# Altium schematic sheet Hall Effect Sensors Panel.SchDoc
size B; SheetNumber: 1; SheetTotal: 1
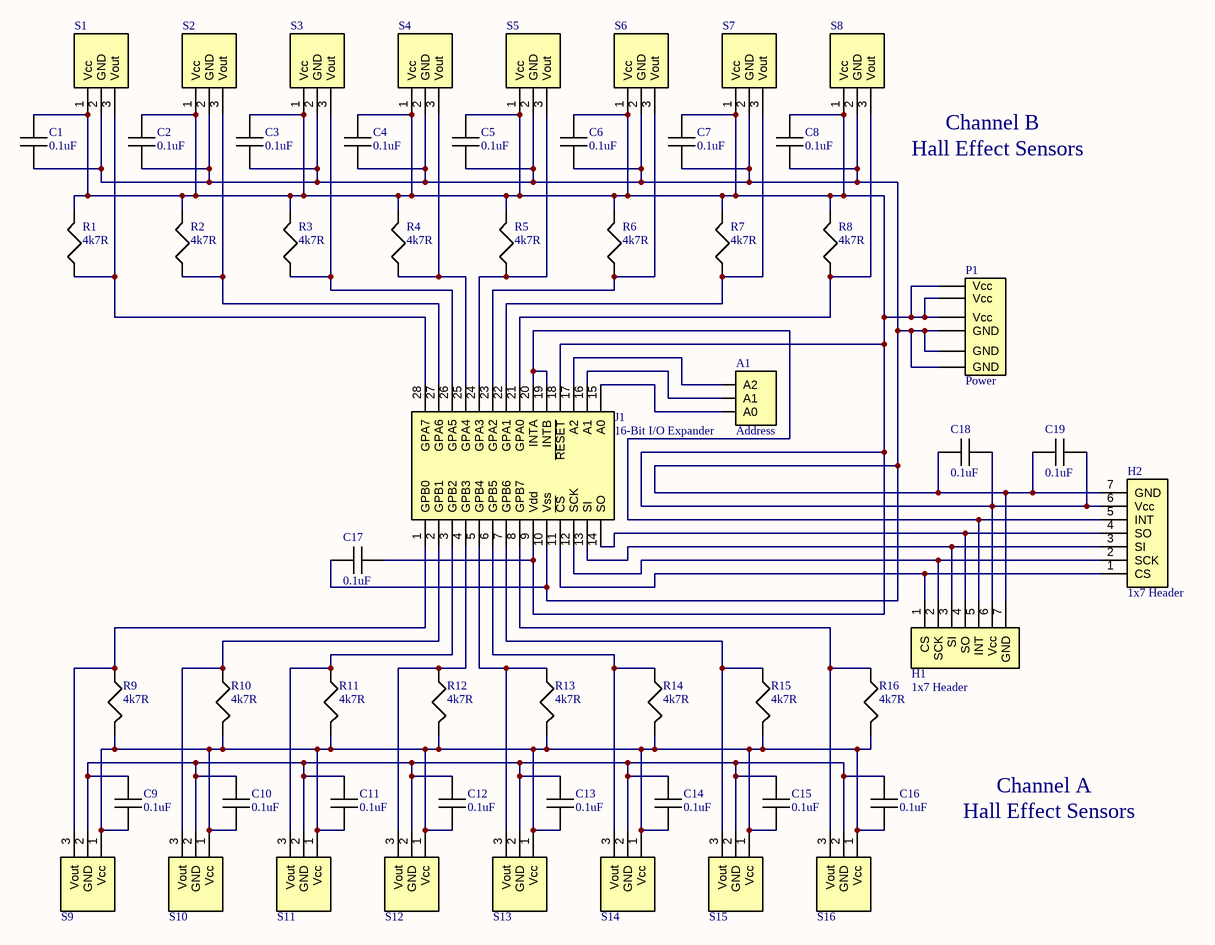
[diagram p0: Hall Effect Sensors Panel.SchDoc]

## Parts
A1  Address  [Address]
C1  0.1uF  [C320C104K5R5TA]
C2  0.1uF  [C320C104K5R5TA]
C3  0.1uF  [C320C104K5R5TA]
C4  0.1uF  [C320C104K5R5TA]
C5  0.1uF  [C320C104K5R5TA]
C6  0.1uF  [C320C104K5R5TA]
C7  0.1uF  [C320C104K5R5TA]
C8  0.1uF  [C320C104K5R5TA]
C9  0.1uF  [C320C104K5R5TA]
C10  0.1uF  [C320C104K5R5TA]
C11  0.1uF  [C320C104K5R5TA]
C12  0.1uF  [C320C104K5R5TA]
C13  0.1uF  [C320C104K5R5TA]
C14  0.1uF  [C320C104K5R5TA]
C15  0.1uF  [C320C104K5R5TA]
C16  0.1uF  [C320C104K5R5TA]
C17  0.1uF  [C320C104K5R5TA]
C18  0.1uF  [C320C104K5R5TA]
C19  0.1uF  [C320C104K5R5TA]
H1  1x7 Header  [PCB Header]
H2  1x7 Header  [PCB Header]
J1  16-Bit I/O Expander  [MCP23S17-E/SP]
P1  Power  [Power]
R1  4k7R  [CFR100J4K7]
R2  4k7R  [CFR100J4K7]
R3  4k7R  [CFR100J4K7]
R4  4k7R  [CFR100J4K7]
R5  4k7R  [CFR100J4K7]
R6  4k7R  [CFR100J4K7]
R7  4k7R  [CFR100J4K7]
R8  4k7R  [CFR100J4K7]
R9  4k7R  [CFR100J4K7]
R10  4k7R  [CFR100J4K7]
R11  4k7R  [CFR100J4K7]
R12  4k7R  [CFR100J4K7]
R13  4k7R  [CFR100J4K7]
R14  4k7R  [CFR100J4K7]
R15  4k7R  [CFR100J4K7]
R16  4k7R  [CFR100J4K7]
S1  Hall Effect Sensor  [A1104EUA-T]  (value not drawn)
S2  Hall Effect Sensor  [A1104EUA-T]  (value not drawn)
S3  Hall Effect Sensor  [A1104EUA-T]  (value not drawn)
S4  Hall Effect Sensor  [A1104EUA-T]  (value not drawn)
S5  Hall Effect Sensor  [A1104EUA-T]  (value not drawn)
S6  Hall Effect Sensor  [A1104EUA-T]  (value not drawn)
S7  Hall Effect Sensor  [A1104EUA-T]  (value not drawn)
S8  Hall Effect Sensor  [A1104EUA-T]  (value not drawn)
S9  Hall Effect Sensor  [A1104EUA-T]  (value not drawn)
S10  Hall Effect Sensor  [A1104EUA-T]  (value not drawn)
S11  Hall Effect Sensor  [A1104EUA-T]  (value not drawn)
S12  Hall Effect Sensor  [A1104EUA-T]  (value not drawn)
S13  Hall Effect Sensor  [A1104EUA-T]  (value not drawn)
S14  Hall Effect Sensor  [A1104EUA-T]  (value not drawn)
S15  Hall Effect Sensor  [A1104EUA-T]  (value not drawn)
S16  Hall Effect Sensor  [A1104EUA-T]  (value not drawn)

## Nets
NetA1_1: A1.1(A0) J1.15(A0)
NetA1_2: A1.2(A1) J1.16(A1)
NetA1_3: A1.3(A2) J1.17(A2)
NetC1_1: C1.1 C2.1 C3.1 C4.1 C5.1 C6.1 C7.1 C8.1 C17.2 C18.2 C19.2 H1.6(Vcc) H2.6(Vcc) J1.9(Vdd) J1.18(~{RESET}) P1.1(Vcc) P1.2(Vcc) P1.3(Vcc) R1.2 R2.2 R3.2 R4.2 R5.2 R6.2 R7.2 R8.2 S1.1(Vcc) S2.1(Vcc) S3.1(Vcc) S4.1(Vcc) S5.1(Vcc) S6.1(Vcc) S7.1(Vcc) S8.1(Vcc)
NetC1_2: C1.2 C2.2 C3.2 C4.2 C5.2 C6.2 C7.2 C8.2 C17.1 C18.1 C19.1 H1.7(GND) H2.7(GND) J1.10(Vss) P1.4(GND) P1.5(GND) P1.6(GND) S1.2(GND) S2.2(GND) S3.2(GND) S4.2(GND) S5.2(GND) S6.2(GND) S7.2(GND) S8.2(GND)
NetC9_1: C9.1 C10.1 C11.1 C12.1 C13.1 C14.1 C15.1 C16.1 R9.2 R10.2 R11.2 R12.2 R13.2 R14.2 R15.2 R16.2 S9.1(Vcc) S10.1(Vcc) S11.1(Vcc) S12.1(Vcc) S13.1(Vcc) S14.1(Vcc) S15.1(Vcc) S16.1(Vcc)
NetC9_2: C9.2 C10.2 C11.2 C12.2 C13.2 C14.2 C15.2 C16.2 S9.2(GND) S10.2(GND) S11.2(GND) S12.2(GND) S13.2(GND) S14.2(GND) S15.2(GND) S16.2(GND)
NetH1_1: H1.1(CS) H2.1(CS) J1.11(~{CS})
NetH1_2: H1.2(SCK) H2.2(SCK) J1.12(SCK)
NetH1_3: H1.3(SI) H2.3(SI) J1.13(SI)
NetH1_4: H1.4(SO) H2.4(SO) J1.14(SO)
NetH1_5: H1.5(INT) H2.5(INT) J1.19(INTB) J1.20(INTA)
NetJ1_1: J1.1(GPB0) R9.1 S9.3(Vout)
NetJ1_2: J1.2(GPB1) R10.1 S10.3(Vout)
NetJ1_3: J1.3(GPB2) R11.1 S11.3(Vout)
NetJ1_4: J1.4(GPB3) R12.1 S12.3(Vout)
NetJ1_5: J1.5(GPB4) R13.1 S13.3(Vout)
NetJ1_6: J1.6(GPB5) R14.1 S14.3(Vout)
NetJ1_7: J1.7(GPB6) R15.1 S15.3(Vout)
NetJ1_8: J1.8(GPB7) R16.1 S16.3(Vout)
NetJ1_21: J1.21(GPA0) R8.1 S8.3(Vout)
NetJ1_22: J1.22(GPA1) R7.1 S7.3(Vout)
NetJ1_23: J1.23(GPA2) R6.1 S6.3(Vout)
NetJ1_24: J1.24(GPA3) R5.1 S5.3(Vout)
NetJ1_25: J1.25(GPA4) R4.1 S4.3(Vout)
NetJ1_26: J1.26(GPA5) R3.1 S3.3(Vout)
NetJ1_27: J1.27(GPA6) R2.1 S2.3(Vout)
NetJ1_28: J1.28(GPA7) R1.1 S1.3(Vout)

## Notes on the sheet
- Hall Effect Sensors
- Channel B
- Channel A
- DWG. NO.
- REV.
- SHT.
- THIS DOCUMENT AND THE DATA DISCLOSED HEREIN OR HEREWITH IS THE PROPERTY OF ALTIUM LIMITED AND MAY BE FREELY DISTRIBUTED IN WHOLE. NO RIGHTS ARE RESERVED OR EXPRESS OR IMPLIED WARANTEE GIVEN.
- REVISION
- DESCRIPTION
- DATE
- APPROVED
- ENG:
- APPROVALS
- PROJECT
- DSN:
- CHK:
- REFERENCE DOCUMENTS
- PROJECT REVISION:
- TITLE
- DOCUMENT REVISION:
- DESIGN ITEM:
- BOM:
- FAB DWG:
- PCB DWG:
- ASSY DWG:
- SCALE:
- SIZE
- B
- CAGE CODE
- FILE NAME
- DWG NO.
- SHEET
- OF
- REV

## Library data of the parts
C1-C19 = C320C104K5R5TA: KEMET - C320C104K5R5TA - Multilayer Ceramic Capacitor, Gold Max, 0.1 µF, 50 V, Goldmax, 300 Series, ± 10%, Radial Leaded; Capacitance: 100nF; Dielectric: X7R; Voltage Rating: 50V; Lead/Base Style: Straight; Dissipation Factor: 2.5%; Lead Diameter: 0.51mm; Lead Length: 7mm; Supplier 1: RSComponents; Manufacturer: KEMET; Manufacturer Part Number: C320C104K5R5TA; RoHS: Yes; Category: Ceramic Capacitors; Mount: Through Hole,PCB; Case/Package: Radial; Number of Pins: 2; Dielectric Material: Ceramic; Min Operating Temperature: -55°C; Max Operating Temperature: 125°C; Tolerance: 10%; Packaging: Bulk; Termination: Radial; Voltage Rating (DC): 50V; Package Quantity: 500; Resistor Type: Ceramic; Voltage: 50V; Length: 5.08mm; Width: 0.125inch; Height: 3.18mm; Lead Pitch: 2.54mm; Depth: 3.18mm; Height - Seated (Max): 0.26inch; Radiation Hardening: No; RoHS Compliant: Yes; REACH SVHC: No SVHC; Lead Free: Lead Free; ComponentLink1URL: https://datasheet.ciiva.com/27052/1570161-27052544.pdf?src-supplier=Jameco; ComponentLink1Description: https://datasheet.ciiva.com/27052/1570161-27052544.pdf?src-supplier=Jameco; ComponentLink2URL: https://datasheet.ciiva.com/39122/f3101-goldmax-39122993.pdf?src-supplier=Onlinecomponents.com; ComponentLink2Description: https://datasheet.ciiva.com/39122/f3101-goldmax-39122993.pdf?src-supplier=Onlinecomponents.com; ComponentLink3URL: https://datasheet.ciiva.com/11786/0900766b80717e24-11786584.pdf?src-supplier=RSComponents; ComponentLink3Description: https://datasheet.ciiva.com/11786/0900766b80717e24-11786584.pdf?src-supplier=RSComponents; ComponentLink4URL: https://datasheet.ciiva.com/7817/1732702-7817354.pdf?src-supplier=Element14; ComponentLink4Description: https://datasheet.ciiva.com/7817/1732702-7817354.pdf?src-supplier=Element14; ComponentLink5URL: https://datasheet.ciiva.com/16624/datasheetpn-c320c104k5r5ca-16624750.pdf?src-supplier=Avnet+Europe; ComponentLink5Description: https://datasheet.ciiva.com/16624/datasheetpn-c320c104k5r5ca-16624750.pdf?src-supplier=Avnet+Europe; ComponentLink6URL: https://datasheet.ciiva.com/7817/f3101-goldmax-7817514.pdf?src-supplier=Element14; ComponentLink6Description: https://datasheet.ciiva.com/7817/f3101-goldmax-7817514.pdf?src-supplier=Element14; ComponentLink7URL: https://datasheet.ciiva.com/14585/70095037-14585005.pdf?src-supplier=Allied+Electronics; ComponentLink7Description: https://datasheet.ciiva.com/14585/70095037-14585005.pdf?src-supplier=Allied+Electronics; ComponentLink8URL: https://datasheet.ciiva.com/5389/f3101-goldmax-334604-5389886.pdf?src-supplier=Mouser; ComponentLink8Description: https://datasheet.ciiva.com/5389/f3101-goldmax-334604-5389886.pdf?src-supplier=Mouser; Supplier Part Number 1: 1466304
H1 H2 = 22-23-2071: CONN HEADER VERT 7POS 2.54MM; Manufacturer: Molex; Number of Contacts: 7; Contact Resistance: 10mR; Gender: Male; Max Voltage Rating (AC): 250V; Current Rating: 4A; Max Current Rating: 10A; Insulation Resistance: 500GR; Approvals: UL,CSA; Glow Wire Compliant: Non-compliant; Supplier 1: RSComponents; Manufacturer Part Number: 22-23-2071; RoHS: Yes; Category: Headers and Wire Housings; Stock 1: 4279; Pricing 1: 10=0.34600 (USD); Mount: Through Hole,Cable; Contact Plating: Tin,Copper; Contact Material: Brass; Color: White; Housing Color: White; Housing Material: Nylon; Min Operating Temperature: 0°C; Max Operating Temperature: 75°C; Termination: Through Hole; Number of Rows: 1; Packaging: Bulk; Orientation: Straight; Number of Positions: 7; Series: 6373; Package Quantity: 4000; Voltage Rating: 250V; Contact Gender: Male; Voltage Rating (DC): 250V; Number of Circuits: 7; Height: 4.5mm; Pitch: 2.54mm; Depth: 3.56mm; Radiation Hardening: No; RoHS Compliant: Yes; REACH SVHC: Unknown; Halogen Free: Low Halogen; Lead Free: Lead Free; Flammability Rating: UL94 V-0; ComponentLink1URL: https://datasheet.ciiva.com/30052/39000022232071-pcb-headers-30052246.pdf?src-supplier=Onlinecomponents.com; ComponentLink1Description: https://datasheet.ciiva.com/30052/39000022232071-pcb-headers-30052246.pdf?src-supplier=Onlinecomponents.com; ComponentLink2URL: https://datasheet.ciiva.com/7839/1575011-7839927.pdf?src-supplier=Element14; ComponentLink2Description: https://datasheet.ciiva.com/7839/1575011-7839927.pdf?src-supplier=Element14; ComponentLink3URL: https://datasheet.ciiva.com/5154/0022232071-pcb-headers-227102-5154393.pdf?src-supplier=Mouser; ComponentLink3Description: https://datasheet.ciiva.com/5154/0022232071-pcb-headers-227102-5154393.pdf?src-supplier=Mouser; ComponentLink4URL: https://datasheet.ciiva.com/11749/0900766b80d8f4d1-11749289.pdf?src-supplier=RSComponents; ComponentLink4Description: https://datasheet.ciiva.com/11749/0900766b80d8f4d1-11749289.pdf?src-supplier=RSComponents; ComponentLink5URL: https://datasheet.ciiva.com/19462/1966270-19462253.pdf?src-supplier=Jameco; ComponentLink5Description: https://datasheet.ciiva.com/19462/1966270-19462253.pdf?src-supplier=Jameco; ComponentLink6URL: https://datasheet.ciiva.com/49273/232311-49273642.pdf?src-supplier=Jameco; ComponentLink6Description: https://datasheet.ciiva.com/49273/232311-49273642.pdf?src-supplier=Jameco; ComponentLink7URL: https://datasheet.ciiva.com/16725/0022232071-pcb-headers-16725645.pdf?src-supplier=Avnet+Europe; ComponentLink7Description: https://datasheet.ciiva.com/16725/0022232071-pcb-headers-16725645.pdf?src-supplier=Avnet+Europe; ComponentLink8URL: https://datasheet.ciiva.com/10087/0022232071-pcb-headers-10087214.pdf?src-supplier=Avnet; ComponentLink8Description: https://datasheet.ciiva.com/10087/0022232071-pcb-headers-10087214.pdf?src-supplier=Avnet; Supplier Part Number 1: 6795603P
J1 = MCP23S17-E/SP: TE CONNECTIVITY         CFR100J4K7             Through Hole Resistor, 4.7 kohm, 500 V, Axial Leaded, 1 W,  5%, CFR Series; Manufacturer: Microchip; Interface: SPI,Serial; Nominal Supply Current: 1mA; Number of Channels: 1; Min Supply Voltage: 1.8V; Max Supply Voltage: 5.5V; Number of I/Os: 16; Frequency: 10MHz; Temperature Coefficient: 0ppm/°C; Resistance: 4.7kR; Power Rating: 1W; Voltage Rating: 500V; Supplier 1: RSComponents; Manufacturer Part Number: MCP23S17-E/SP; RoHS: Yes; Category: Interface ICs; Stock 1: 210; Pricing 1: 15=1.29300, 30=1.22600, 105=1.10500 (USD); Mount: Through Hole,Surface Mount; Case/Package: PDIP; Number of Pins: 28; Min Operating Temperature: -40°C; Max Operating Temperature: 125°C; Packaging: Rail/Tube; Max Frequency: 10MHz; Number of Bits: 16; Supply Voltage-Nom: 5.5V; Supply Current: 1mA; REACH SVHC: No SVHC; Lead Free: Lead Free; RoHS Compliant: Yes; ComponentLink1URL: https://datasheet.ciiva.com/12096/21952b-70868-12096976.pdf?src-supplier=Mouser; ComponentLink1Description: https://datasheet.ciiva.com/12096/21952b-70868-12096976.pdf?src-supplier=Mouser; ComponentLink2URL: https://datasheet.ciiva.com/1780/21952b-1780558.pdf?src-supplier=Digi-Key; ComponentLink2Description: https://datasheet.ciiva.com/1780/21952b-1780558.pdf?src-supplier=Digi-Key; ComponentLink3URL: https://datasheet.ciiva.com/1495/12179-1495925.pdf?src-supplier=Element14; ComponentLink3Description: https://datasheet.ciiva.com/1495/12179-1495925.pdf?src-supplier=Element14; ComponentLink4URL: https://datasheet.ciiva.com/1496/12179-1496067.pdf?src-supplier=Element14; ComponentLink4Description: https://datasheet.ciiva.com/1496/12179-1496067.pdf?src-supplier=Element14; ComponentLink5URL: https://datasheet.ciiva.com/16331/filehandler-aspxddocname-en023709-16331287.pdf?src-supplier=Future+Electronics; ComponentLink5Description: https://datasheet.ciiva.com/16331/filehandler-aspxddocname-en023709-16331287.pdf?src-supplier=Future+Electronics; ComponentLink6URL: https://datasheet.ciiva.com/16617/21952b-16617642.pdf?src-supplier=Avnet+Europe; ComponentLink6Description: https://datasheet.ciiva.com/16617/21952b-16617642.pdf?src-supplier=Avnet+Europe; ComponentLink7URL: https://datasheet.ciiva.com/18405/70046137-18405548.pdf?src-supplier=Allied+Electronics; ComponentLink7Description: https://datasheet.ciiva.com/18405/70046137-18405548.pdf?src-supplier=Allied+Electronics; ComponentLink8URL: https://datasheet.ciiva.com/29305/651444-da-01-en-ic-i-o-exp-mcp23s17-e-sp-spdip-28-mcp-29305148.pdf?src-supplier=Conrad; ComponentLink8Description: https://datasheet.ciiva.com/29305/651444-da-01-en-ic-i-o-exp-mcp23s17-e-sp-spdip-28-mcp-29305148.pdf?src-supplier=Conrad; Supplier Part Number 1: 9126833; Stock 2: 2440; Pricing 2: 10=0.11800, 100=0.10100, 250=0.08900, 500=0.07500, 1000=0.06400 (USD); Number of Terminations: 2; Termination: Axial; Resistor Type: Thin Film; Tolerance: 5%; Number of Resistors: 1; Voltage Rating (DC): 500V; Diameter: 5mm; Length: 12mm; ELV: Compliant; ComponentLink9URL: https://datasheet.ciiva.com/11823/0900766b80098b49-11823401.pdf?src-supplier=RSComponents; ComponentLink9Description: https://datasheet.ciiva.com/11823/0900766b80098b49-11823401.pdf?src-supplier=RSComponents; ComponentLink10URL: https://datasheet.ciiva.com/22664/1723854-22664921.pdf?src-supplier=Element14; ComponentLink10Description: https://datasheet.ciiva.com/22664/1723854-22664921.pdf?src-supplier=Element14; ComponentLink11URL: https://datasheet.ciiva.com/16773/70063023-16773435.pdf?src-supplier=Allied+Electronics; ComponentLink11Description: https://datasheet.ciiva.com/16773/70063023-16773435.pdf?src-supplier=Allied+Electronics
R1-R16 = CFR100J4K7: TE CONNECTIVITY         CFR100J4K7             Through Hole Resistor, 4.7 kohm, 500 V, Axial Leaded, 1 W,  5%, CFR Series; Temperature Coefficient: 0ppm/°C; Resistance: 4.7kR; Power Rating: 1W; Number of Resistors: 1; Voltage Rating: 500V; Supplier 1: RSComponents; Manufacturer: TE Connectivity; Manufacturer Part Number: CFR100J4K7; RoHS: Yes; Category: Through-Hole Resistors; Stock 1: 2440; Pricing 1: 10=0.11800, 100=0.10100, 250=0.08900, 500=0.07500, 1000=0.06400 (USD); Mount: Axial; Case/Package: Conformal; Min Operating Temperature: -55°C; Max Operating Temperature: 155°C; Number of Terminations: 2; Termination: Axial; Packaging: Ammo Pack; Resistor Type: Thin Film; Tolerance: 5%; Voltage Rating (DC): 500V; Diameter: 5mm; Length: 12mm; REACH SVHC: No SVHC; ELV: Compliant; ComponentLink1URL: https://datasheet.ciiva.com/11823/0900766b80098b49-11823401.pdf?src-supplier=RSComponents; ComponentLink1Description: https://datasheet.ciiva.com/11823/0900766b80098b49-11823401.pdf?src-supplier=RSComponents; ComponentLink2URL: https://datasheet.ciiva.com/22664/1723854-22664921.pdf?src-supplier=Element14; ComponentLink2Description: https://datasheet.ciiva.com/22664/1723854-22664921.pdf?src-supplier=Element14; ComponentLink3URL: https://datasheet.ciiva.com/16773/70063023-16773435.pdf?src-supplier=Allied+Electronics; ComponentLink3Description: https://datasheet.ciiva.com/16773/70063023-16773435.pdf?src-supplier=Allied+Electronics; Supplier Part Number 1: 0131873
S1-S16 = A1104EUA-T: ALLEGRO MICROSYSTEMS - A1104EUA-T - IC, HALL-EFFECT SWITCH SIP-3; Output Current: 25mA; Max Supply Current: 7.5mA; Min Supply Voltage: 3.8V; Max Supply Voltage: 24V; Output Type: Digital; Supplier 1: RSComponents; Manufacturer: Allegro MicroSystems; Manufacturer Part Number: A1104EUA-T; RoHS: Yes; Category: Magnetic Sensors; Stock 1: 245; Pricing 1: 5=1.09300, 25=0.90800, 100=0.76300, 250=0.71200, 500=0.67100 (USD); Mount: Through Hole; Case/Package: SIP; Number of Pins: 3; Min Operating Temperature: -40°C; Max Operating Temperature: 85°C; Packaging: Bulk; Package Quantity: 4000; Operating Supply Current: 7.5mA; Max Output Current: 25mA; Type: Unipolar Switch; Length: 4.09mm; Width: 1.52mm; Height: 3.02mm; Radiation Hardening: No; REACH SVHC: No SVHC; Lead Free: Lead Free; RoHS Compliant: Yes; ComponentLink1URL: https://datasheet.ciiva.com/15099/getdatasheetpartid-305695-15099469.pdf?src-supplier=Verical; ComponentLink1Description: https://datasheet.ciiva.com/15099/getdatasheetpartid-305695-15099469.pdf?src-supplier=Verical; ComponentLink2URL: https://datasheet.ciiva.com/1173/1697218-1173986.pdf?src-supplier=Newark; ComponentLink2Description: https://datasheet.ciiva.com/1173/1697218-1173986.pdf?src-supplier=Newark; ComponentLink3URL: https://datasheet.ciiva.com/3272/a110x-datasheet-3272173.pdf?src-supplier=Avnet; ComponentLink3Description: https://datasheet.ciiva.com/3272/a110x-datasheet-3272173.pdf?src-supplier=Avnet; Supplier Part Number 1: 6807488